# Altium project nir_usb.PrjPcb
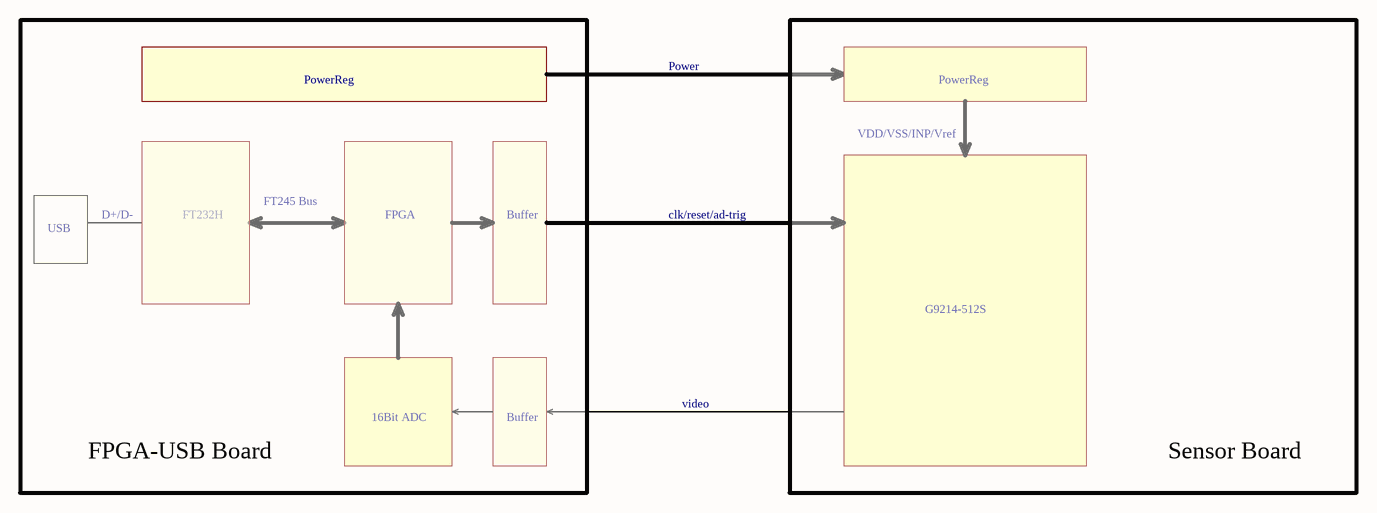
[diagram p0: nir_usb_top.SchDoc]
12 sheets, 173 parts. Net scope: global (net labels, ports and power ports of the same name join across sheets).
Board file: nir_usb.PcbDoc
Sheets:
  nir_usb_top.SchDoc
  place_plan.SchDoc
  calculation_plan.SchDoc
  ft232h.SchDoc
  fpga_io.SchDoc
  fpga_pwr.SchDoc
  adc.SchDoc
  fpga_misc.SchDoc
  adc_buffer.SchDoc
  digi_pwr.SchDoc
  analog_pwr.SchDoc
  digi_5V.SchDoc

## Sheet nir_usb_top.SchDoc
size A4

### Notes on the sheet
- Power
- PowerReg
- VDD/VSS/INP/Vref
- FT245 Bus
- USB
- D+/D-
- FT232H
- FPGA
- Buffer
- clk/reset/ad-trig
- G9214-512S
- video
- FPGA-USB Board
- 16Bit ADC
- Sensor Board

## Sheet place_plan.SchDoc
size A4
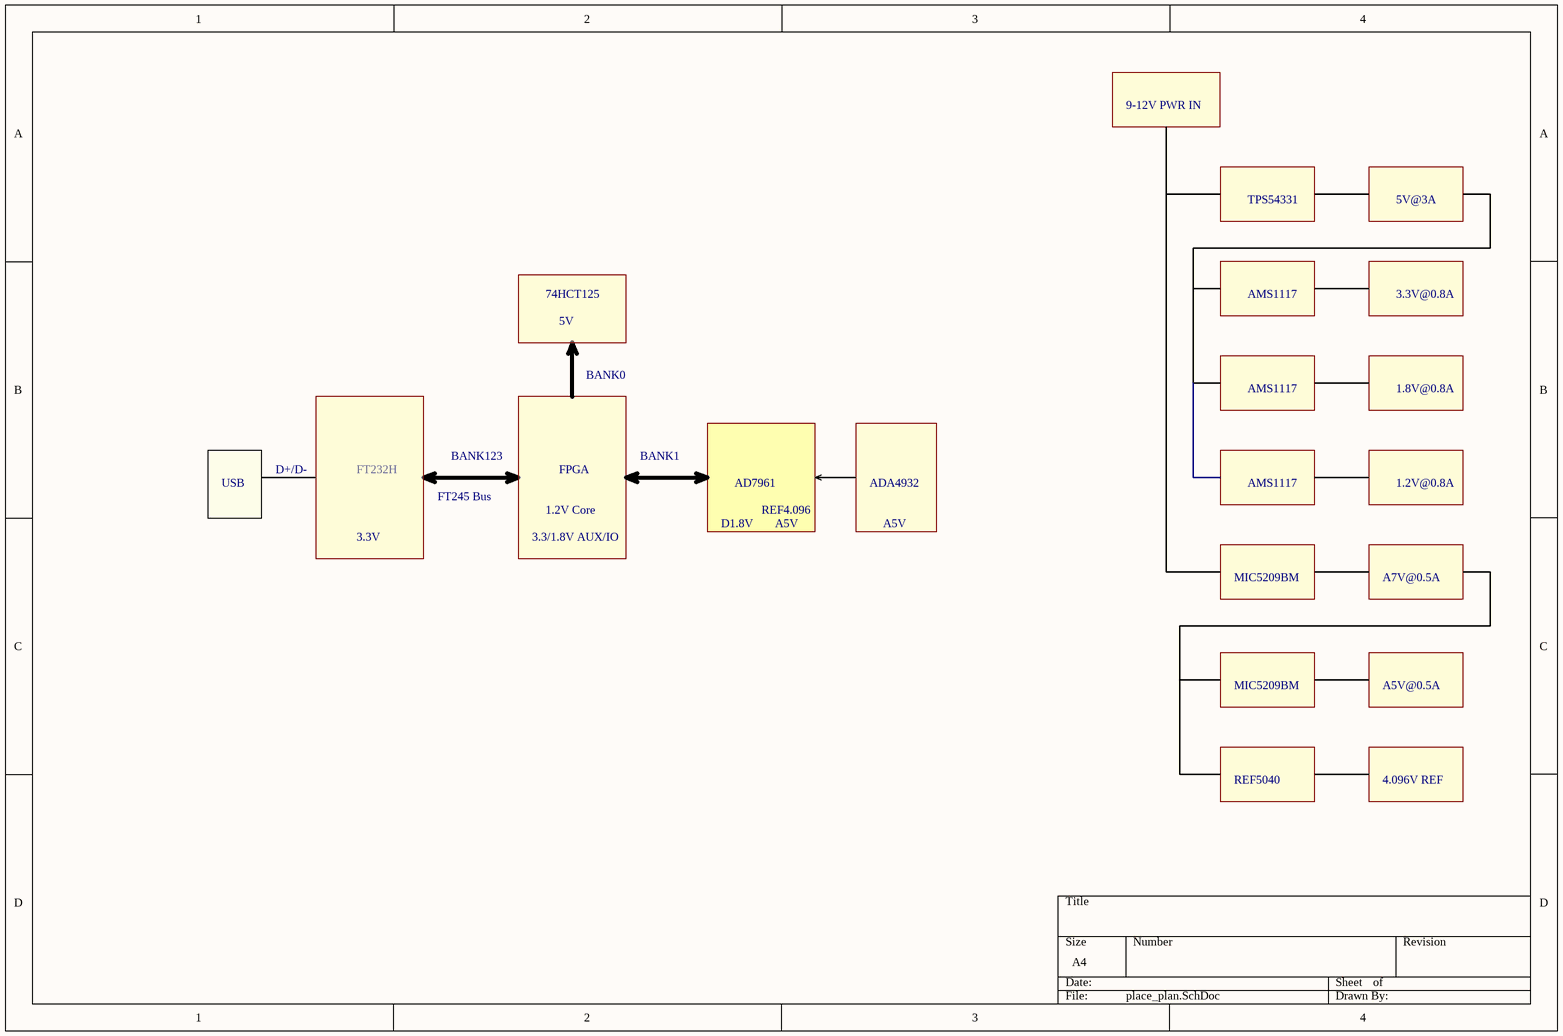
[diagram p1: place_plan.SchDoc]

### Notes on the sheet
- 9-12V PWR IN
- TPS54331
- 5V@3A
- 74HCT125
- AMS1117
- 3.3V@0.8A
- 5V
- BANK0
- 1.8V@0.8A
- USB
- D+/D-
- FT232H
- FT245 Bus
- BANK123
- 1.2V Core
- FPGA
- BANK1
- AD7961
- REF4.096
- ADA4932
- 1.2V@0.8A
- 3.3V
- 3.3/1.8V AUX/IO
- D1.8V
- A5V
- MIC5209BM
- A7V@0.5A
- A5V@0.5A
- REF5040
- 4.096V REF

## Sheet calculation_plan.SchDoc
size A4
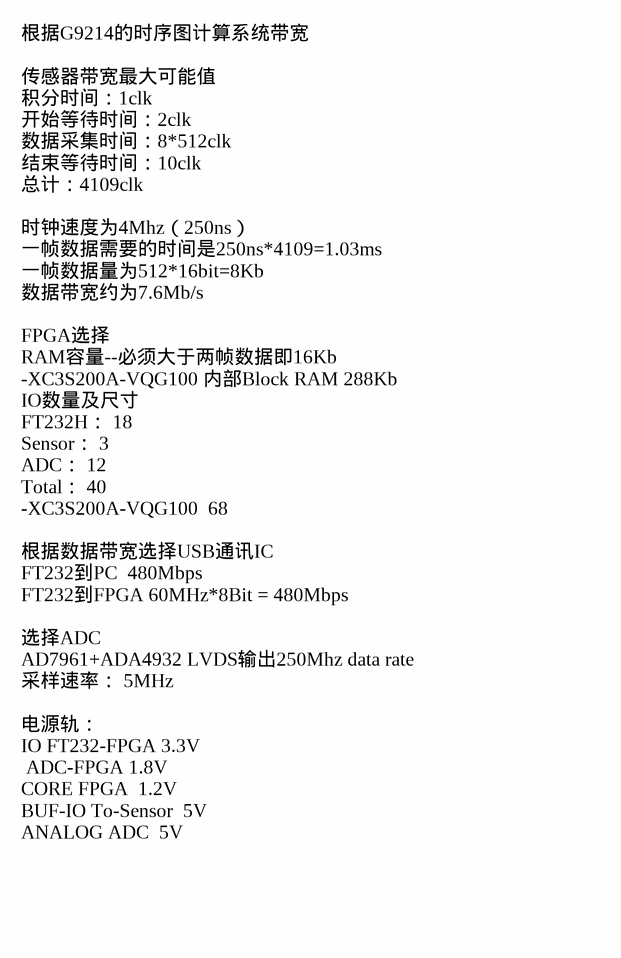
[diagram p2: calculation_plan.SchDoc]

### Notes on the sheet
- 根据G9214的时序图计算系统带宽
  传感器带宽最大可能值
  积分时间：1clk
  开始等待时间：2clk
  数据采集时间：8*512clk
  结束等待时间：10clk
  总计：4109clk
  时钟速度为4Mhz（250ns）
  一帧数据需要的时间是250ns*4109=1.03ms
  一帧数据量为512*16bit=8Kb
  数据带宽约为7.6Mb/s
  FPGA选择
  RAM容量--必须大于两帧数据即16Kb
  -XC3S200A-VQG100 内部Block RAM 288Kb
  IO数量及尺寸
  FT232H：	18
  Sensor：	3
  ADC：	12
  Total：	40
  -XC3S200A-VQG100 	68
  根据数据带宽选择USB通讯IC
  FT232到PC 	480Mbps
  FT232到FPGA	60MHz*8Bit = 480Mbps
  选择ADC
  AD7961+ADA4932	LVDS输出250Mhz data rate
  采样速率：	5MHz
  电源轨：
  IO	FT232-FPGA	3.3V
  ADC-FPGA	1.8V
  CORE	FPGA		1.2V
  BUF-IO	To-Sensor		5V
  ANALOG	ADC		5V

## Sheet ft232h.SchDoc
size A4
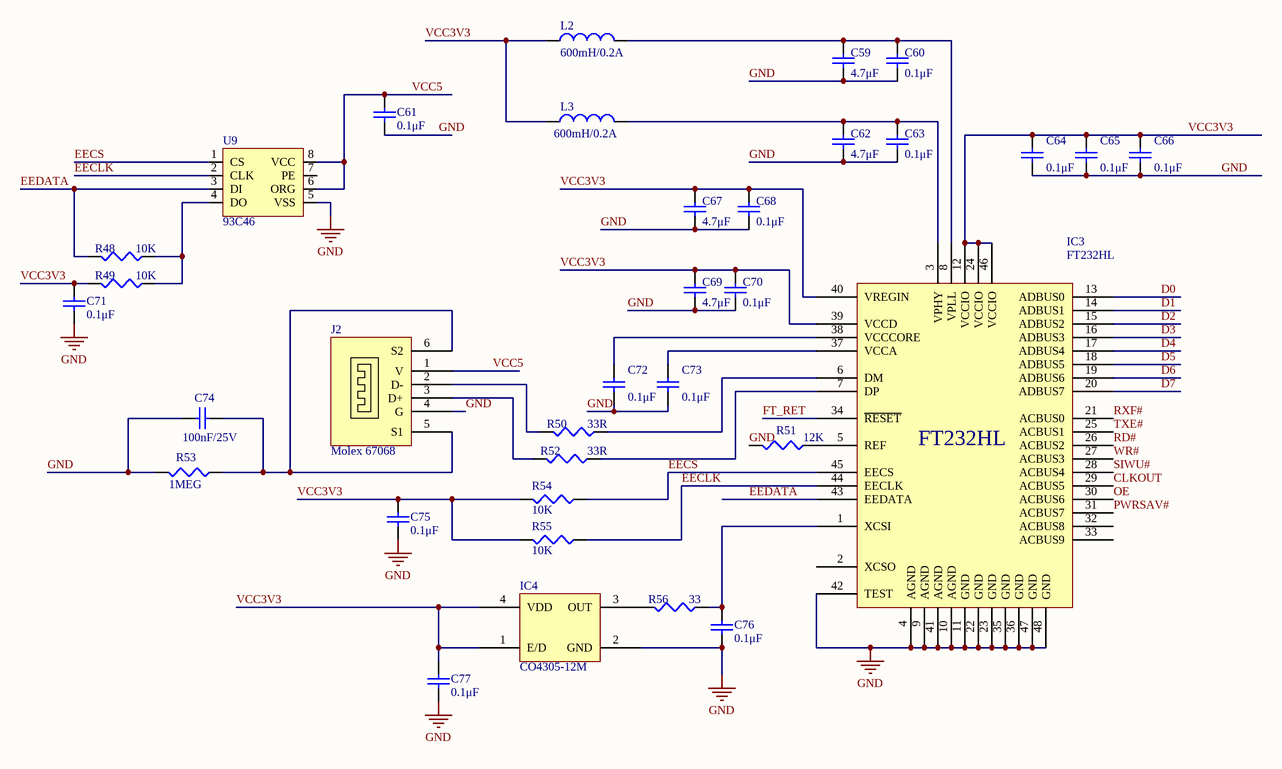
[diagram p3: ft232h.SchDoc]

### Parts
C59  value 4.7μF  [1608[0603]]  (hidden comment: Cap Semi)
C60  value 0.1μF  [1608[0603]]  (hidden comment: Cap Semi)
C61  value 0.1μF  [1608[0603]]  (hidden comment: Cap Semi)
C62  value 4.7μF  [1608[0603]]  (hidden comment: Cap Semi)
C63  value 0.1μF  [1608[0603]]  (hidden comment: Cap Semi)
C64  value 0.1μF  [1608[0603]]  (hidden comment: Cap Semi)
C65  value 0.1μF  [1608[0603]]  (hidden comment: Cap Semi)
C66  value 0.1μF  [1608[0603]]  (hidden comment: Cap Semi)
C67  value 4.7μF  [1608[0603]]  (hidden comment: Cap Semi)
C68  value 0.1μF  [1608[0603]]  (hidden comment: Cap Semi)
C69  value 4.7μF  [1608[0603]]  (hidden comment: Cap Semi)
C70  value 0.1μF  [1608[0603]]  (hidden comment: Cap Semi)
C71  value 0.1μF  [1608[0603]]  (hidden comment: Cap Semi)
C72  value 0.1μF  [1608[0603]]  (hidden comment: Cap Semi)
C73  value 0.1μF  [1608[0603]]  (hidden comment: Cap Semi)
C74  value 100nF/25V  [1608[0603]]  (hidden comment: Cap Semi)
C75  value 0.1μF  [1608[0603]]  (hidden comment: Cap Semi)
C76  value 0.1μF  [1608[0603]]  (hidden comment: Cap Semi)
C77  value 0.1μF  [1608[0603]]  (hidden comment: Cap Semi)
IC3  FT232HL  [LQFP-48_L]
IC4  CO4305-12M  [CO4305-12]
J2  Molex 67068  [USB-A]
L2  value 600mH/0.2A  [0603]  (hidden comment: Inductor)
L3  value 600mH/0.2A  [0603]  (hidden comment: Inductor)
R48  value 10K  [J1-0603]  (hidden comment: Res3)
R49  value 10K  [J1-0603]  (hidden comment: Res3)
R50  value 33R  [J1-0603]  (hidden comment: Res3)
R51  value 12K  [J1-0603]  (hidden comment: Res3)
R52  value 33R  [J1-0603]  (hidden comment: Res3)
R53  value 1MEG  [J1-0603]  (hidden comment: Res3)
R54  value 10K  [J1-0603]  (hidden comment: Res3)
R55  value 10K  [J1-0603]  (hidden comment: Res3)
R56  value 33  [J1-0603]  (hidden comment: Res3)
U9  93C46  [SOIC127P600X175-8N]

### Nets
GND: C59.1 C60.1 C61.1 C62.1 C63.1 C64.1 C65.1 C66.1 C67.1 C68.1 C69.1 C70.1 C71.1 C72.1 C73.1 C74.1 C75.1 C76.1 C77.1 IC3.4(AGND) IC3.9(AGND) IC3.10(AGND) IC3.11(GND) IC3.22(GND) IC3.23(GND) IC3.35(GND) IC3.36(GND) IC3.41(AGND) IC3.42(TEST) IC3.47(GND) IC3.48(GND) IC4.2(GND) J2.4(G) R51.2 R53.2 U9.5(VSS)
CLKOUT: IC3.29(ACBUS5)
D0: IC3.13(ADBUS0)
D1: IC3.14(ADBUS1)
D2: IC3.15(ADBUS2)
D3: IC3.16(ADBUS3)
D4: IC3.17(ADBUS4)
D5: IC3.18(ADBUS5)
D6: IC3.19(ADBUS6)
D7: IC3.20(ADBUS7)
EECLK: IC3.44(EECLK) R55.1 U9.2(CLK)
EECS: IC3.45(EECS) R54.1 U9.1(CS)
EEDATA: IC3.43(EEDATA) R48.2 U9.3(DI)
FT_RET: IC3.34(~{RESET})
OE: IC3.30(ACBUS6)
PWRSAV#: IC3.31(ACBUS7)
RD#: IC3.26(ACBUS2)
RXF#: IC3.21(ACBUS0)
SIWU#: IC3.28(ACBUS4)
TXE#: IC3.25(ACBUS1)
VCC3V3: C64.2 C65.2 C66.2 C67.2 C68.2 C69.2 C70.2 C71.2 C75.2 C77.2 IC3.12(VCCIO) IC3.24(VCCIO) IC3.39(VCCD) IC3.40(VREGIN) IC3.46(VCCIO) IC4.1(E/D) IC4.4(VDD) L2.1 L3.1 R49.2 R54.2 R55.2
VCC5: C61.2 J2.1(V) U9.6(ORG) U9.8(VCC)
WR#: IC3.27(ACBUS3)
NetC59_2: C59.2 C60.2 IC3.8(VPLL) L2.2
NetC62_2: C62.2 C63.2 IC3.3(VPHY) L3.2
NetC72_2: C72.2 IC3.38(VCCCORE)
NetC73_2: C73.2 IC3.37(VCCA)
NetC74_2: C74.2 J2.5(S1) J2.6(S2) R53.1
NetC76_2: C76.2 IC3.1(XCSI) R56.1
NetIC3_5: IC3.5(REF) R51.1
NetIC3_6: IC3.6(DM) R50.1
NetIC3_7: IC3.7(DP) R52.1
NetIC4_3: IC4.3(OUT) R56.2
NetJ2_2: J2.2(D-) R50.2
NetJ2_3: J2.3(D+) R52.2
NetR48_1: R48.1 R49.1 U9.4(DO)

Not connected (* = marked no-connect by the designer): IC3 2(XCSO) 32(ACBUS8) 33(ACBUS9); U9 7(PE)

### Library data of the parts
C59-C77 = Cap Semi: Capacitor (Semiconductor SIM Model); Published: 8-Jun-2000; LatestRevisionDate: 29-May-2009; LatestRevisionNote: IPC-7351 Footprint Added.; PackageReference: C1206; Publisher: Altium Limited; PackageDescription: Chip Capacitor
L2 L3 = Inductor: Code_IEC: 1005; Published: 8-Jun-2000; LatestRevisionDate: 29-May-2009; LatestRevisionNote: IPC-7351 Footprint Added.; PackageReference: 0402-A; Publisher: Altium Limited; PackageDescription: Chip Inductor; Code_JEITA: 0402
R48-R56 = Res3: Resistor; Published: 8-Jun-2000; LatestRevisionDate: 29-May-2009; LatestRevisionNote: IPC-7351 Footprint Added.; PackageReference: J1-0603; Publisher: Altium Limited; PackageDescription: Chip Resistor

## Sheet fpga_io.SchDoc
size A4
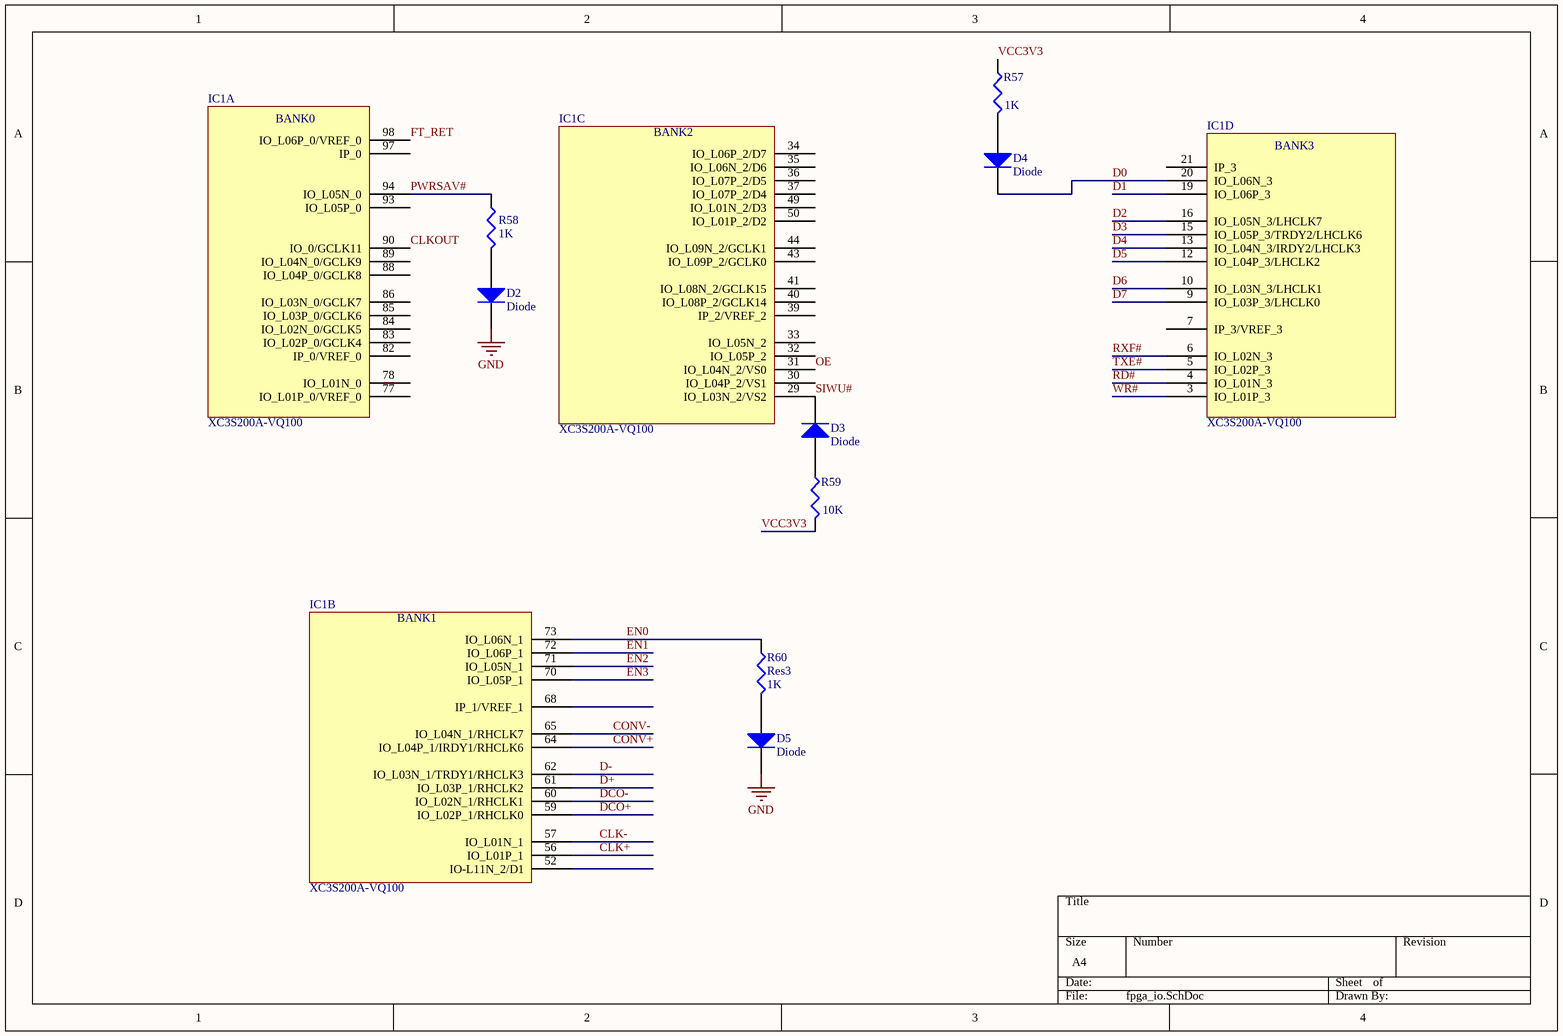
[diagram p4: fpga_io.SchDoc]

### Parts
D2  Diode  [LED0603]
D3  Diode  [LED0603]
D4  Diode  [LED0603]
D5  Diode  [LED0603]
IC1  XC3S200A-VQ100  [QFP50P1600X1600X120-100N]  (parts A,B,C,D of 6)
R57  value 1K  [J1-0603]  (hidden comment: Res3)
R58  value 1K  [J1-0603]  (hidden comment: Res3)
R59  value 10K  [J1-0603]  (hidden comment: Res3)
R60  Res3  value 1K  [J1-0603]

### Nets
GND: D2.2(K) D5.2(K)
CLK+: IC1.56(IO_L01P_1)
CLK-: IC1.57(IO_L01N_1)
CLKOUT: IC1.90(IO_0/GCLK11)
CONV+: IC1.64(IO_L04P_1/IRDY1/RHCLK6)
CONV-: IC1.65(IO_L04N_1/RHCLK7)
D0: D4.2(K) IC1.20(IO_L06N_3)
D1: IC1.19(IO_L06P_3)
D2: IC1.16(IO_L05N_3/LHCLK7)
D3: IC1.15(IO_L05P_3/TRDY2/LHCLK6)
D4: IC1.13(IO_L04N_3/IRDY2/LHCLK3)
D5: IC1.12(IO_L04P_3/LHCLK2)
D6: IC1.10(IO_L03N_3/LHCLK1)
D7: IC1.9(IO_L03P_3/LHCLK0)
D+: IC1.61(IO_L03P_1/RHCLK2)
D-: IC1.62(IO_L03N_1/TRDY1/RHCLK3)
DCO+: IC1.59(IO_L02P_1/RHCLK0)
DCO-: IC1.60(IO_L02N_1/RHCLK1)
EN0: IC1.73(IO_L06N_1) R60.1
EN1: IC1.72(IO_L06P_1)
EN2: IC1.71(IO_L05N_1)
EN3: IC1.70(IO_L05P_1)
FT_RET: IC1.98(IO_L06P_0/VREF_0)
OE: IC1.31(IO_L04N_2/VS0)
PWRSAV#: IC1.94(IO_L05N_0) R58.1
RD#: IC1.4(IO_L01N_3)
RXF#: IC1.6(IO_L02N_3)
SIWU#: D3.2(K) IC1.29(IO_L03N_2/VS2)
TXE#: IC1.5(IO_L02P_3)
VCC3V3: R57.1 R59.2
WR#: IC1.3(IO_L01P_3)
NetD2_1: D2.1(A) R58.2
NetD3_1: D3.1(A) R59.1
NetD4_1: D4.1(A) R57.2
NetD5_1: D5.1(A) R60.2

Not connected (* = marked no-connect by the designer): IC1 7(IP_3/VREF_3) 21(IP_3) 30(IO_L04P_2/VS1) 32(IO_L05P_2) 33(IO_L05N_2) 34(IO_L06P_2/D7) 35(IO_L06N_2/D6) 36(IO_L07P_2/D5) 37(IO_L07P_2/D4) 39(IP_2/VREF_2) 40(IO_L08P_2/GCLK14) 41(IO_L08N_2/GCLK15) 43(IO_L09P_2/GCLK0) 44(IO_L09N_2/GCLK1) 49(IO_L01N_2/D3) 50(IO_L01P_2/D2) 52(IO-L11N_2/D1) 68(IP_1/VREF_1) 77(IO_L01P_0/VREF_0) 78(IO_L01N_0) 82(IP_0/VREF_0) 83(IO_L02P_0/GCLK4) 84(IO_L02N_0/GCLK5) 85(IO_L03P_0/GCLK6) 86(IO_L03N_0/GCLK7) 88(IO_L04P_0/GCLK8) 89(IO_L04N_0/GCLK9) 93(IO_L05P_0) 97(IP_0)

### Notes on the sheet
- (in symbol XC3S200A-VQ100, part A) BANK0
- (in symbol XC3S200A-VQ100, part B) BANK1
- (in symbol XC3S200A-VQ100, part C) BANK2
- (in symbol XC3S200A-VQ100, part D) BANK3

### Library data of the parts
D2-D5 = Diode: Default Diode; Published: 8-Jun-2000; LatestRevisionDate: 17-Jul-2002; LatestRevisionNote: Re-released for DXP Platform.; PackageVersion: Sep-1996; PackageReference: SMC; Publisher: Altium Limited; PackageDescription: DO-214-AB/SMC; 2 C-Bend Leads; Body 7.9 x 5.9 mm, inc. leads (LxW); Code_JEDEC: DO-214-AB
R57-R60 = Res3: Resistor; Published: 8-Jun-2000; LatestRevisionDate: 29-May-2009; LatestRevisionNote: IPC-7351 Footprint Added.; PackageReference: J1-0603; Publisher: Altium Limited; PackageDescription: Chip Resistor

## Sheet fpga_pwr.SchDoc
size A4
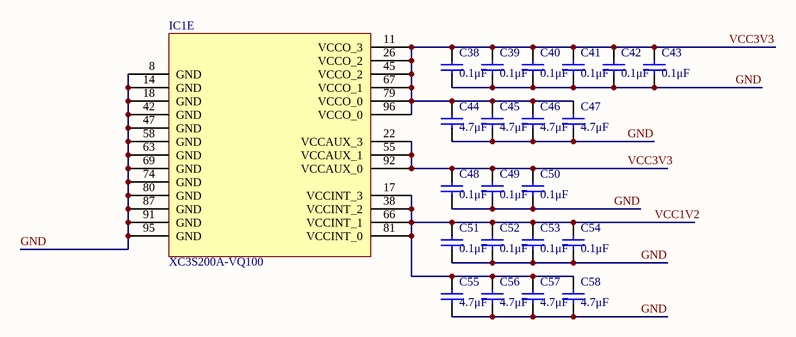
[diagram p5: fpga_pwr.SchDoc]

### Parts
C38  value 0.1μF  [1608[0603]]  (hidden comment: Cap Semi)
C39  value 0.1μF  [1608[0603]]  (hidden comment: Cap Semi)
C40  value 0.1μF  [1608[0603]]  (hidden comment: Cap Semi)
C41  value 0.1μF  [1608[0603]]  (hidden comment: Cap Semi)
C42  value 0.1μF  [1608[0603]]  (hidden comment: Cap Semi)
C43  value 0.1μF  [1608[0603]]  (hidden comment: Cap Semi)
C44  value 4.7μF  [1608[0603]]  (hidden comment: Cap Semi)
C45  value 4.7μF  [1608[0603]]  (hidden comment: Cap Semi)
C46  value 4.7μF  [1608[0603]]  (hidden comment: Cap Semi)
C47  value 4.7μF  [1608[0603]]  (hidden comment: Cap Semi)
C48  value 0.1μF  [1608[0603]]  (hidden comment: Cap Semi)
C49  value 0.1μF  [1608[0603]]  (hidden comment: Cap Semi)
C50  value 0.1μF  [1608[0603]]  (hidden comment: Cap Semi)
C51  value 0.1μF  [1608[0603]]  (hidden comment: Cap Semi)
C52  value 0.1μF  [1608[0603]]  (hidden comment: Cap Semi)
C53  value 0.1μF  [1608[0603]]  (hidden comment: Cap Semi)
C54  value 0.1μF  [1608[0603]]  (hidden comment: Cap Semi)
C55  value 4.7μF  [1608[0603]]  (hidden comment: Cap Semi)
C56  value 4.7μF  [1608[0603]]  (hidden comment: Cap Semi)
C57  value 4.7μF  [1608[0603]]  (hidden comment: Cap Semi)
C58  value 4.7μF  [1608[0603]]  (hidden comment: Cap Semi)
IC1  XC3S200A-VQ100  [QFP50P1600X1600X120-100N]  (part E of 6)

### Nets
GND: C38.1 C39.1 C40.1 C41.1 C42.1 C43.1 C44.1 C45.1 C46.1 C47.1 C48.1 C49.1 C50.1 C51.1 C52.1 C53.1 C54.1 C55.1 C56.1 C57.1 C58.1 IC1.8(GND) IC1.14(GND) IC1.18(GND) IC1.42(GND) IC1.47(GND) IC1.58(GND) IC1.63(GND) IC1.69(GND) IC1.74(GND) IC1.80(GND) IC1.87(GND) IC1.91(GND) IC1.95(GND)
VCC1V2: C51.2 C52.2 C53.2 C54.2 C55.2 C56.2 C57.2 C58.2 IC1.17(VCCINT_3) IC1.38(VCCINT_2) IC1.66(VCCINT_1) IC1.81(VCCINT_0)
VCC3V3: C38.2 C39.2 C40.2 C41.2 C42.2 C43.2 C44.2 C45.2 C46.2 C47.2 C48.2 C49.2 C50.2 IC1.11(VCCO_3) IC1.22(VCCAUX_3) IC1.26(VCCO_2) IC1.45(VCCO_2) IC1.55(VCCAUX_1) IC1.67(VCCO_1) IC1.79(VCCO_0) IC1.92(VCCAUX_0) IC1.96(VCCO_0)

### Library data of the parts
C38-C58 = Cap Semi: Capacitor (Semiconductor SIM Model); Published: 8-Jun-2000; LatestRevisionDate: 29-May-2009; LatestRevisionNote: IPC-7351 Footprint Added.; PackageReference: C1206; Publisher: Altium Limited; PackageDescription: Chip Capacitor

## Sheet adc.SchDoc
size A4
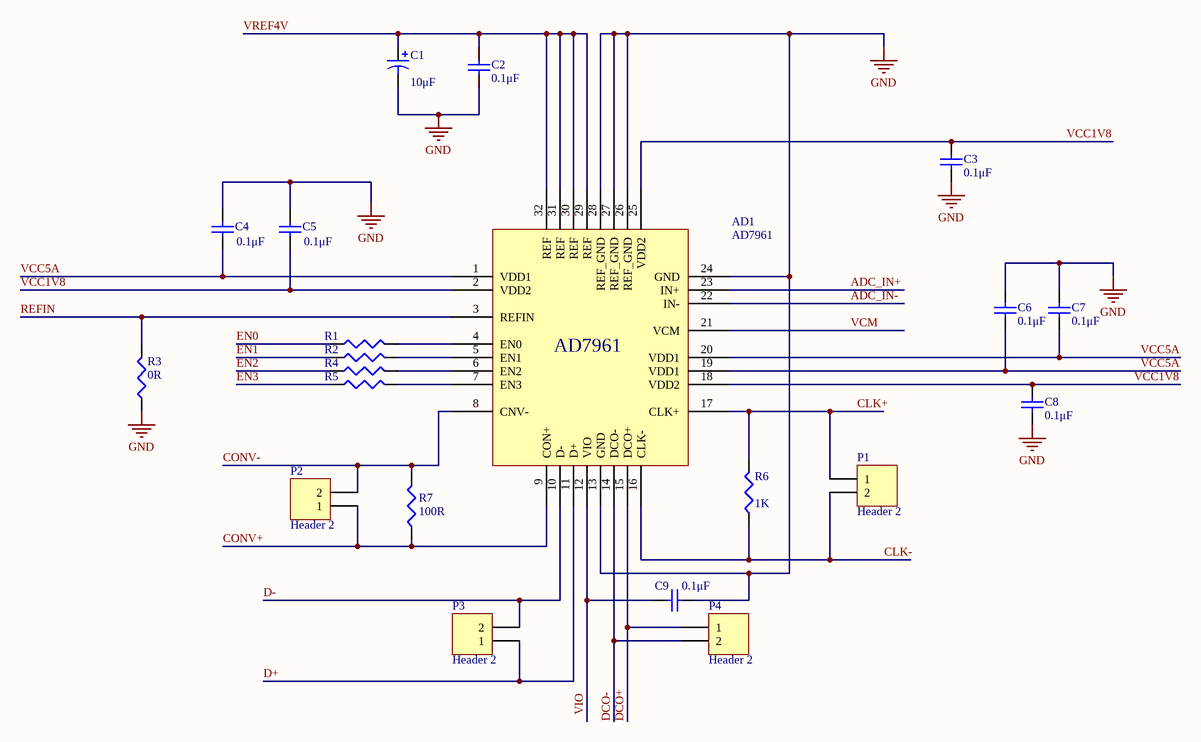
[diagram p6: adc.SchDoc]

### Parts
AD1  AD7961  [QFN50P500X500X80-33N]
C1  value 10μF  [C0805]  (hidden comment: Cap Pol3)
C2  value 0.1μF  [1608[0603]]  (hidden comment: Cap Semi)
C3  value 0.1μF  [1608[0603]]  (hidden comment: Cap Semi)
C4  value 0.1μF  [1608[0603]]  (hidden comment: Cap Semi)
C5  value 0.1μF  [1608[0603]]  (hidden comment: Cap Semi)
C6  value 0.1μF  [1608[0603]]  (hidden comment: Cap Semi)
C7  value 0.1μF  [1608[0603]]  (hidden comment: Cap Semi)
C8  value 0.1μF  [1608[0603]]  (hidden comment: Cap Semi)
C9  value 0.1μF  [1608[0603]]  (hidden comment: Cap Semi)
P1  Header 2  [HDR1X2]
P2  Header 2  [HDR1X2]
P3  Header 2  [HDR1X2]
P4  Header 2  [HDR1X2]
R1  Res3  [J1-0603]  (value not drawn)
R2  Res3  [J1-0603]  (value not drawn)
R3  0R  [J1-0603]
R4  Res3  [J1-0603]  (value not drawn)
R5  Res3  [J1-0603]  (value not drawn)
R6  value 1K  [J1-0603]  (hidden comment: Res3)
R7  value 100R  [J1-0603]  (hidden comment: Res3)

### Nets
GND: AD1.13(GND) AD1.24(GND) AD1.26(REF_GND) AD1.27(REF_GND) AD1.28(REF_GND) C1.2 C2.2 C3.2 C4.2 C5.2 C6.1 C7.1 C8.2 C9.1 R3.1
ADC_IN+: AD1.23(IN+)
ADC_IN-: AD1.22(IN-)
CLK+: AD1.17(CLK+) P1.1 R6.2
CLK-: AD1.16(CLK-) P1.2 R6.1
CONV+: AD1.9(CON+) P2.1 R7.1
CONV-: AD1.8(CNV-) P2.2 R7.2
D+: AD1.11(D+) P3.1
D-: AD1.10(D-) P3.2
DCO+: AD1.15(DCO+) P4.1
DCO-: AD1.14(DCO-) P4.2
EN0: R1.1
EN1: R2.1
EN2: R4.1
EN3: R5.1
REFIN: AD1.3(REFIN) R3.2
VCC1V8: AD1.2(VDD2) AD1.18(VDD2) AD1.25(VDD2) C3.1 C5.1 C8.1
VCC5A: AD1.1(VDD1) AD1.19(VDD1) AD1.20(VDD1) C4.1 C6.2 C7.2
VCM: AD1.21(VCM)
VIO: AD1.12(VIO) C9.2
VREF4V: AD1.29(REF) AD1.30(REF) AD1.31(REF) AD1.32(REF) C1.1 C2.1
NetAD1_4: AD1.4(EN0) R1.2
NetAD1_5: AD1.5(EN1) R2.2
NetAD1_6: AD1.6(EN2) R4.2
NetAD1_7: AD1.7(EN3) R5.2

### Library data of the parts
C1 = Cap Pol3: Polarized Capacitor (Surface Mount); Published: 8-Jun-2000; LatestRevisionDate: 29-May-2009; LatestRevisionNote: IPC-7351 Footprint Added.; PackageReference: C0805; Publisher: Altium Limited; PackageDescription: Chip Capacitor
C2-C9 = Cap Semi: Capacitor (Semiconductor SIM Model); Published: 8-Jun-2000; LatestRevisionDate: 29-May-2009; LatestRevisionNote: IPC-7351 Footprint Added.; PackageReference: C1206; Publisher: Altium Limited; PackageDescription: Chip Capacitor
P1-P4 = Header 2: Header, 2-Pin; LatestRevisionDate: 17-Jul-2002; LatestRevisionNote: Re-released for DXP Platform.; Publisher: Altium Limited
R1-R5 = Res3: Resistor; Value: 1K; Published: 8-Jun-2000; LatestRevisionDate: 29-May-2009; LatestRevisionNote: IPC-7351 Footprint Added.; PackageReference: J1-0603; Publisher: Altium Limited; PackageDescription: Chip Resistor
R6 R7 = Res3: Resistor; Published: 8-Jun-2000; LatestRevisionDate: 29-May-2009; LatestRevisionNote: IPC-7351 Footprint Added.; PackageReference: J1-0603; Publisher: Altium Limited; PackageDescription: Chip Resistor

## Sheet fpga_misc.SchDoc: MISC
size A4; Date: 2014/04/21; Author: fanhx; DrawnBy: fanhx
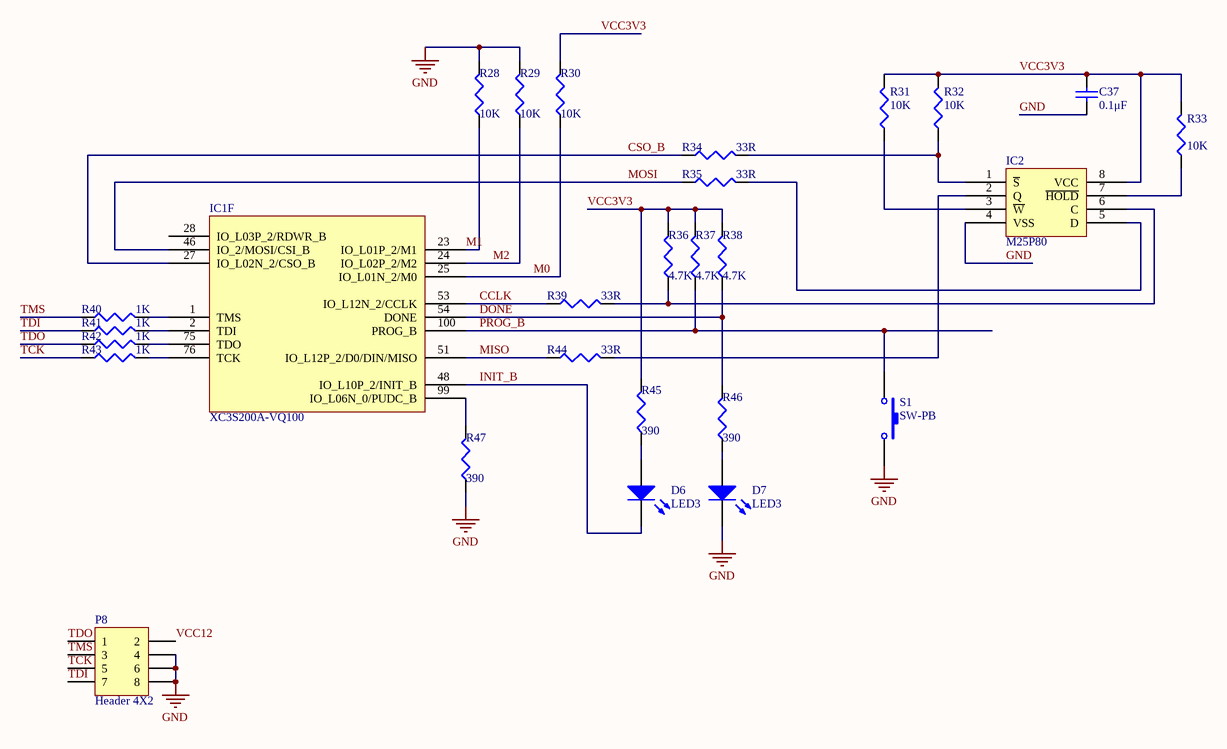
[diagram p7: fpga_misc.SchDoc]

### Parts
C37  value 0.1μF  [1608[0603]]  (hidden comment: Cap Semi)
D6  LED3  [LED0603]
D7  LED3  [LED0603]
IC1  XC3S200A-VQ100  [QFP50P1600X1600X120-100N]  (part F of 6)
IC2  M25P80  [SO8-WIDE8]
P8  Header 4X2  [HDR2X4]
R28  value 10K  [J1-0603]  (hidden comment: Res3)
R29  value 10K  [J1-0603]  (hidden comment: Res3)
R30  value 10K  [J1-0603]  (hidden comment: Res3)
R31  value 10K  [J1-0603]  (hidden comment: Res3)
R32  value 10K  [J1-0603]  (hidden comment: Res3)
R33  value 10K  [J1-0603]  (hidden comment: Res3)
R34  value 33R  [J1-0603]  (hidden comment: Res3)
R35  value 33R  [J1-0603]  (hidden comment: Res3)
R36  value 4.7K  [J1-0603]  (hidden comment: Res3)
R37  value 4.7K  [J1-0603]  (hidden comment: Res3)
R38  value 4.7K  [J1-0603]  (hidden comment: Res3)
R39  value 33R  [J1-0603]  (hidden comment: Res3)
R40  value 1K  [J1-0603]  (hidden comment: Res3)
R41  value 1K  [J1-0603]  (hidden comment: Res3)
R42  value 1K  [J1-0603]  (hidden comment: Res3)
R43  value 1K  [J1-0603]  (hidden comment: Res3)
R44  value 33R  [J1-0603]  (hidden comment: Res3)
R45  value 390  [J1-0603]  (hidden comment: Res3)
R46  value 390  [J1-0603]  (hidden comment: Res3)
R47  value 390  [J1-0603]  (hidden comment: Res3)
S1  SW-PB  [SPST-2]

### Nets
GND: C37.2 D7.2(K) IC2.4(VSS) P8.4 P8.6 P8.8 R28.2 R29.2 R47.1 S1.2
CCLK: IC1.53(IO_L12N_2/CCLK) R39.1
CSO_B: IC1.27(IO_L02N_2/CSO_B) R34.1
DONE: IC1.54(DONE) R38.1 R46.2
INIT_B: D6.2(K) IC1.48(IO_L10P_2/INIT_B)
M0: IC1.25(IO_L01N_2/M0) R30.1
M1: IC1.23(IO_L01P_2/M1) R28.1
M2: IC1.24(IO_L02P_2/M2) R29.1
MISO: IC1.51(IO_L12P_2/D0/DIN/MISO) R44.1
MOSI: IC1.46(IO_2/MOSI/CSI_B) R35.1
PROG_B: IC1.100(PROG_B) R37.1 S1.1
TCK: P8.5 R43.1
TDI: P8.7 R41.1
TDO: P8.1 R42.1
TMS: P8.3 R40.1
VCC3V3: C37.1 IC2.8(VCC) R30.2 R31.2 R32.2 R33.2 R36.2 R37.2 R38.2 R45.2
VCC12: P8.2
NetD6_1: D6.1(A) R45.1
NetD7_1: D7.1(A) R46.1
NetIC1_1: IC1.1(TMS) R40.2
NetIC1_2: IC1.2(TDI) R41.2
NetIC1_75: IC1.75(TDO) R42.2
NetIC1_76: IC1.76(TCK) R43.2
NetIC1_99: IC1.99(IO_L06N_0/PUDC_B) R47.2
NetIC2_1: IC2.1(~{S}) R32.1 R34.2
NetIC2_2: IC2.2(Q) R44.2
NetIC2_3: IC2.3(~{W}) R31.1
NetIC2_5: IC2.5(D) R35.2
NetIC2_6: IC2.6(C) R36.1 R39.2
NetIC2_7: IC2.7(~{HOLD}) R33.1

Not connected (* = marked no-connect by the designer): IC1 28(IO_L03P_2/RDWR_B)

### Library data of the parts
C37 = Cap Semi: Capacitor (Semiconductor SIM Model); Published: 8-Jun-2000; LatestRevisionDate: 29-May-2009; LatestRevisionNote: IPC-7351 Footprint Added.; PackageReference: C1206; Publisher: Altium Limited; PackageDescription: Chip Capacitor
D6 D7 = LED3: Typical BLUE SiC LED; Published: 8-Jun-2000; LatestRevisionDate: 17-Dec-2003; LatestRevisionNote: PCB Footprint replaced.; DatasheetVersion: 16-Apr-2002; PackageVersion: 16-Apr-2002; PackageReference: 3.5X2.8X1.9; Publisher: Altium Limited; PackageDescription: SM LED; 2 C-Bend Leads; Body 3.5 x 2.8 x 1.9 mm, inc leads (LxWxH typ)
P8 = Header 4X2: Header, 4-Pin, Dual row; LatestRevisionDate: 17-Jul-2002; LatestRevisionNote: Re-released for DXP Platform.; Publisher: Altium Limited
R28-R47 = Res3: Resistor; Published: 8-Jun-2000; LatestRevisionDate: 29-May-2009; LatestRevisionNote: IPC-7351 Footprint Added.; PackageReference: J1-0603; Publisher: Altium Limited; PackageDescription: Chip Resistor
S1 = SW-PB: Switch; Published: 24-Mar-1999; LatestRevisionDate: 17-Jul-2002; LatestRevisionNote: Re-released for DXP Platform.; PackageReference: SPST-2; Publisher: Altium Limited; PackageDescription: Switch; 2 Leads

## Sheet adc_buffer.SchDoc
size A4
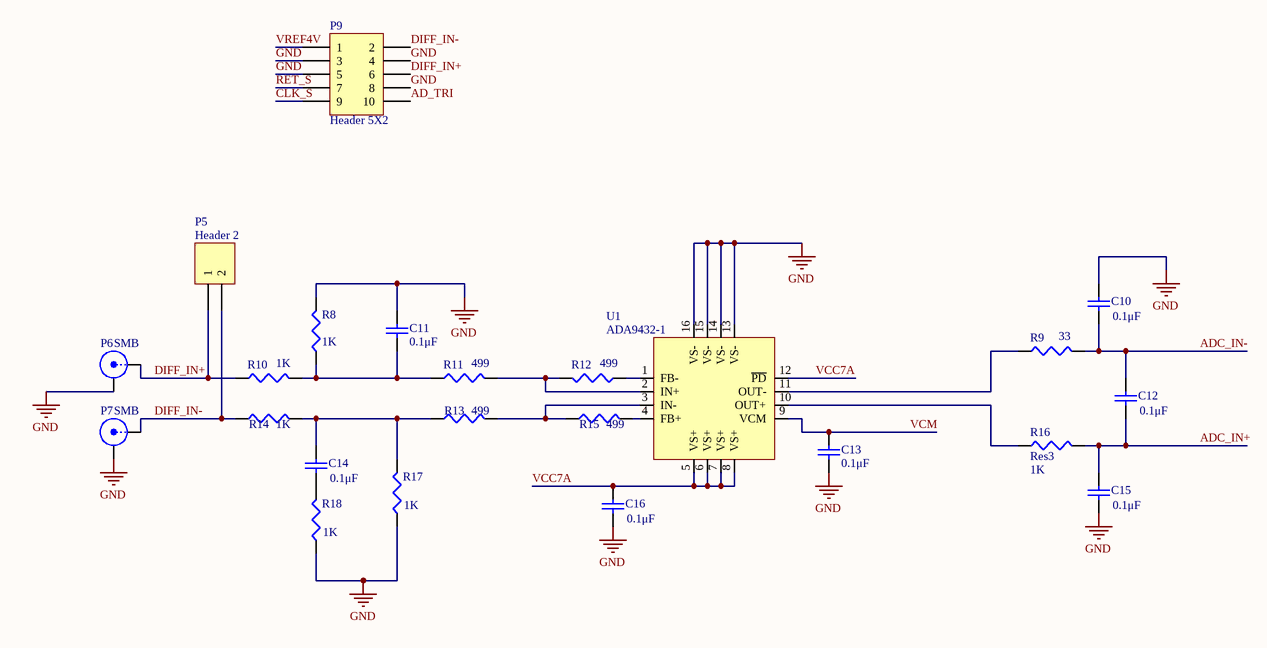
[diagram p8: adc_buffer.SchDoc]

### Parts
C10  value 0.1μF  [1608[0603]]  (hidden comment: Cap Semi)
C11  value 0.1μF  [1608[0603]]  (hidden comment: Cap Semi)
C12  value 0.1μF  [1608[0603]]  (hidden comment: Cap Semi)
C13  value 0.1μF  [1608[0603]]  (hidden comment: Cap Semi)
C14  value 0.1μF  [1608[0603]]  (hidden comment: Cap Semi)
C15  value 0.1μF  [1608[0603]]  (hidden comment: Cap Semi)
C16  value 0.1μF  [1608[0603]]  (hidden comment: Cap Semi)
P5  Header 2  [HDR1X2]
P6  SMB  [SMB_V-RJ45]
P7  SMB  [SMB_V-RJ45]
P9  Header 5X2  [HDR2X5]
R8  value 1K  [J1-0603]  (hidden comment: Res3)
R9  value 33  [J1-0603]  (hidden comment: Res3)
R10  value 1K  [J1-0603]  (hidden comment: Res3)
R11  value 499  [J1-0603]  (hidden comment: Res3)
R12  value 499  [J1-0603]  (hidden comment: Res3)
R13  value 499  [J1-0603]  (hidden comment: Res3)
R14  value 1K  [J1-0603]  (hidden comment: Res3)
R15  value 499  [J1-0603]  (hidden comment: Res3)
R16  Res3  value 1K  [J1-0603]
R17  value 1K  [J1-0603]  (hidden comment: Res3)
R18  value 1K  [J1-0603]  (hidden comment: Res3)
U1  ADA9432-1  [QFN50P300X300X100VQ-17N]

### Nets
GND: C10.2 C11.2 C13.1 C15.1 C16.1 P6.2(Y) P7.2(Y) P9.3 P9.4 P9.5 P9.8 R8.2 R17.1 R18.1 U1.13(VS-) U1.14(VS-) U1.15(VS-) U1.16(VS-)
AD_TRI: P9.10
ADC_IN+: C12.1 C15.2 R16.2
ADC_IN-: C10.1 C12.2 R9.2
CLK_S: P9.9
DIFF_IN+: P5.1 P6.1(X) P9.6 R10.1
DIFF_IN-: P5.2 P7.1(X) P9.2 R14.1
RET_S: P9.7
VCC7A: C16.2 U1.5(VS+) U1.6(VS+) U1.7(VS+) U1.8(VS+) U1.12(~{PD})
VCM: C13.2 U1.9(VCM)
VREF4V: P9.1
NetC11_1: C11.1 R8.1 R10.2 R11.1
NetC14_1: C14.1 R18.2
NetC14_2: C14.2 R13.1 R14.2 R17.2
NetR9_1: R9.1 U1.11(OUT-)
NetR11_2: R11.2 R12.2 U1.2(IN+)
NetR12_1: R12.1 U1.1(FB-)
NetR13_2: R13.2 R15.1 U1.3(IN-)
NetR15_2: R15.2 U1.4(FB+)
NetR16_1: R16.1 U1.10(OUT+)

### Library data of the parts
C10-C16 = Cap Semi: Capacitor (Semiconductor SIM Model); Published: 8-Jun-2000; LatestRevisionDate: 29-May-2009; LatestRevisionNote: IPC-7351 Footprint Added.; PackageReference: C1206; Publisher: Altium Limited; PackageDescription: Chip Capacitor
P5 = Header 2: Header, 2-Pin; LatestRevisionDate: 17-Jul-2002; LatestRevisionNote: Re-released for DXP Platform.; Publisher: Altium Limited
P6 P7 = SMB: SMB Straight Connector; LatestRevisionDate: 17-Jul-2002; LatestRevisionNote: Re-released for DXP Platform.; Publisher: Altium Limited
P9 = Header 5X2: Header, 5-Pin, Dual row; LatestRevisionDate: 17-Jul-2002; LatestRevisionNote: Re-released for DXP Platform.; Publisher: Altium Limited
R8-R18 = Res3: Resistor; Published: 8-Jun-2000; LatestRevisionDate: 29-May-2009; LatestRevisionNote: IPC-7351 Footprint Added.; PackageReference: J1-0603; Publisher: Altium Limited; PackageDescription: Chip Resistor

## Sheet digi_pwr.SchDoc
size A4
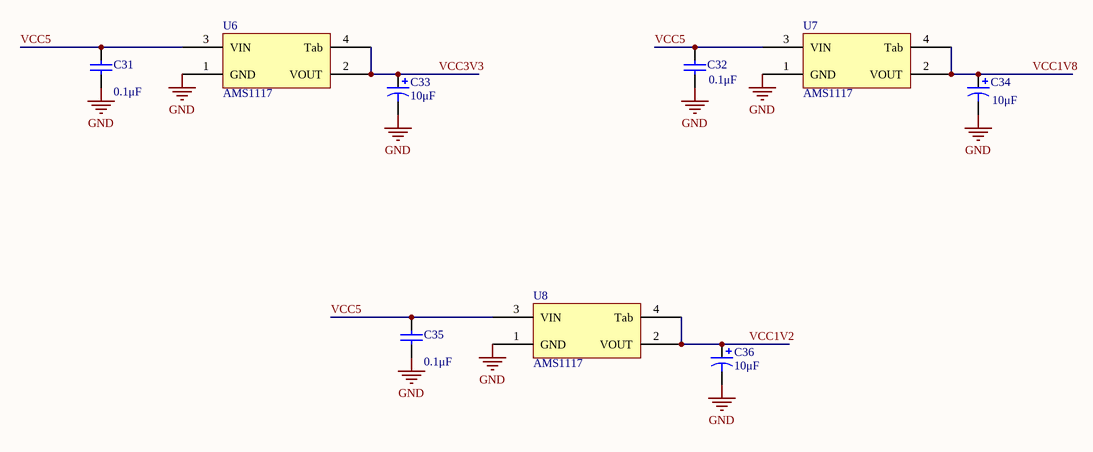
[diagram p9: digi_pwr.SchDoc]

### Parts
C31  value 0.1μF  [1608[0603]]  (hidden comment: Cap Semi)
C32  value 0.1μF  [1608[0603]]  (hidden comment: Cap Semi)
C33  value 10μF  [C0805]  (hidden comment: Cap Pol3)
C34  value 10μF  [C0805]  (hidden comment: Cap Pol3)
C35  value 0.1μF  [1608[0603]]  (hidden comment: Cap Semi)
C36  value 10μF  [C0805]  (hidden comment: Cap Pol3)
U6  AMS1117  [SOT-223]
U7  AMS1117  [SOT-223]
U8  AMS1117  [SOT-223]

### Nets
GND: C31.1 C32.1 C33.2 C34.2 C35.1 C36.2 U6.1(GND) U7.1(GND) U8.1(GND)
VCC1V2: C36.1 U8.2(VOUT) U8.4(Tab)
VCC1V8: C34.1 U7.2(VOUT) U7.4(Tab)
VCC3V3: C33.1 U6.2(VOUT) U6.4(Tab)
VCC5: C31.2 C32.2 C35.2 U6.3(VIN) U7.3(VIN) U8.3(VIN)

### Library data of the parts
C31 C32 C35 = Cap Semi: Capacitor (Semiconductor SIM Model); Published: 8-Jun-2000; LatestRevisionDate: 29-May-2009; LatestRevisionNote: IPC-7351 Footprint Added.; PackageReference: C1206; Publisher: Altium Limited; PackageDescription: Chip Capacitor
C33 C34 C36 = Cap Pol3: Polarized Capacitor (Surface Mount); Published: 8-Jun-2000; LatestRevisionDate: 29-May-2009; LatestRevisionNote: IPC-7351 Footprint Added.; PackageReference: C0805; Publisher: Altium Limited; PackageDescription: Chip Capacitor

## Sheet analog_pwr.SchDoc
size A4
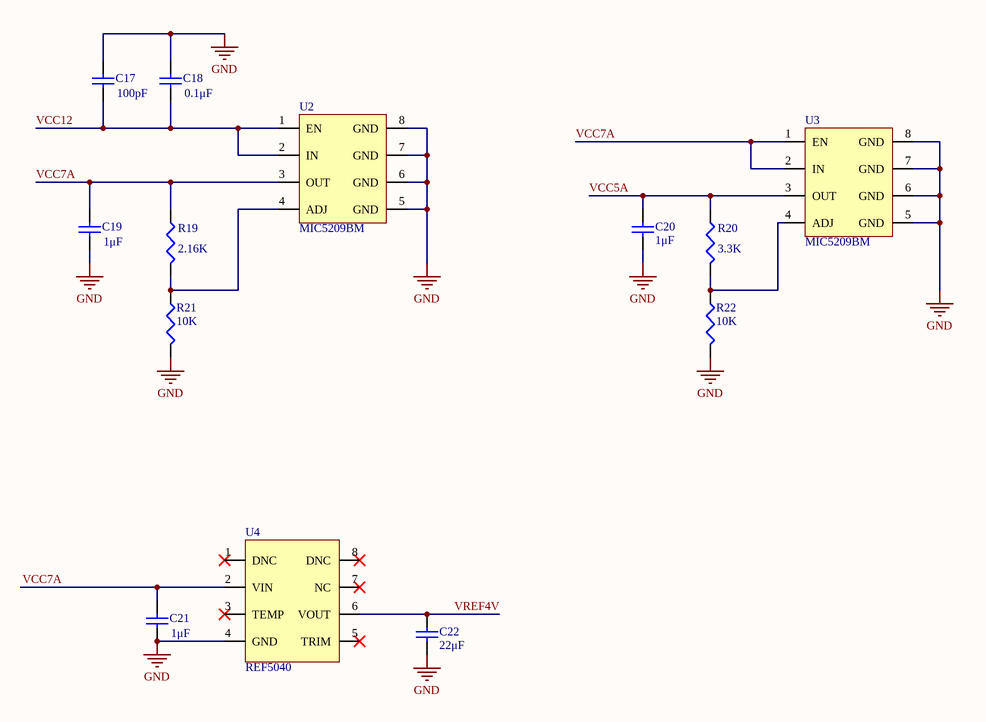
[diagram p10: analog_pwr.SchDoc]

### Parts
C17  value 100pF  [1608[0603]]  (hidden comment: Cap Semi)
C18  value 0.1μF  [1608[0603]]  (hidden comment: Cap Semi)
C19  value 1μF  [1608[0603]]  (hidden comment: Cap Semi)
C20  value 1μF  [1608[0603]]  (hidden comment: Cap Semi)
C21  value 1μF  [1608[0603]]  (hidden comment: Cap Semi)
C22  value 22μF  [1608[0603]]  (hidden comment: Cap Semi)
R19  value 2.16K  [J1-0603]  (hidden comment: Res3)
R20  value 3.3K  [J1-0603]  (hidden comment: Res3)
R21  value 10K  [J1-0603]  (hidden comment: Res3)
R22  value 10K  [J1-0603]  (hidden comment: Res3)
U2  MIC5209BM  [SOIC127P600X175-8N]
U3  MIC5209BM  [SOIC127P600X175-8N]
U4  REF5040  [SOIC127P600X175-8N]

### Nets
GND: C17.2 C18.2 C19.1 C20.1 C21.1 C22.1 R21.2 R22.2 U2.5(GND) U2.6(GND) U2.7(GND) U2.8(GND) U3.5(GND) U3.6(GND) U3.7(GND) U3.8(GND) U4.4(GND)
VCC5A: C20.2 R20.1 U3.3(OUT)
VCC7A: C19.2 C21.2 R19.1 U2.3(OUT) U3.1(EN) U3.2(IN) U4.2(VIN)
VCC12: C17.1 C18.1 U2.1(EN) U2.2(IN)
VREF4V: C22.2 U4.6(VOUT)
NetR19_2: R19.2 R21.1 U2.4(ADJ)
NetR20_2: R20.2 R22.1 U3.4(ADJ)

Not connected (* = marked no-connect by the designer): U4 1(DNC)* 3(TEMP)* 5(TRIM)* 7(NC)* 8(DNC)*

### Library data of the parts
C17-C22 = Cap Semi: Capacitor (Semiconductor SIM Model); Published: 8-Jun-2000; LatestRevisionDate: 29-May-2009; LatestRevisionNote: IPC-7351 Footprint Added.; PackageReference: C1206; Publisher: Altium Limited; PackageDescription: Chip Capacitor
R19-R22 = Res3: Resistor; Published: 8-Jun-2000; LatestRevisionDate: 29-May-2009; LatestRevisionNote: IPC-7351 Footprint Added.; PackageReference: J1-0603; Publisher: Altium Limited; PackageDescription: Chip Resistor

## Sheet digi_5V.SchDoc
size A4
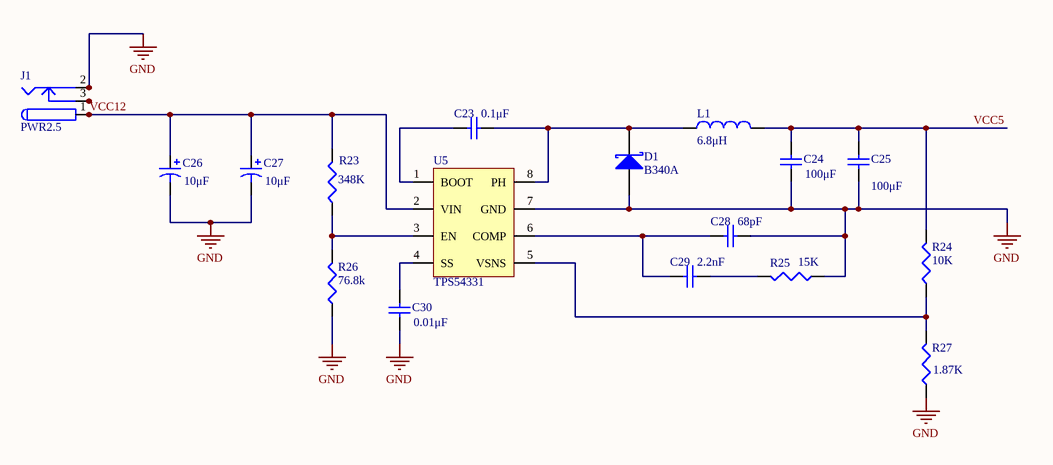
[diagram p11: digi_5V.SchDoc]

### Parts
C23  value 0.1μF  [1608[0603]]  (hidden comment: Cap Semi)
C24  value 100μF  [1608[0603]]  (hidden comment: Cap Semi)
C25  value 100μF  [1608[0603]]  (hidden comment: Cap Semi)
C26  value 10μF  [C0805]  (hidden comment: Cap Pol3)
C27  value 10μF  [C0805]  (hidden comment: Cap Pol3)
C28  value 68pF  [1608[0603]]  (hidden comment: Cap Semi)
C29  value 2.2nF  [1608[0603]]  (hidden comment: Cap Semi)
C30  value 0.01μF  [1608[0603]]  (hidden comment: Cap Semi)
D1  B340A  [LED0603]
J1  PWR2.5  [KLD-0202]
L1  value 6.8μH  [LC Inductor 127]  (hidden comment: Inductor)
R23  value 348K  [J1-0603]  (hidden comment: Res3)
R24  value 10K  [J1-0603]  (hidden comment: Res3)
R25  value 15K  [J1-0603]  (hidden comment: Res3)
R26  value 76.8k  [J1-0603]  (hidden comment: Res3)
R27  value 1.87K  [J1-0603]  (hidden comment: Res3)
U5  TPS54331  [SOIC127P600X175-8N]

### Nets
GND: C24.1 C25.1 C26.2 C27.2 C28.1 C30.1 D1.1(A) J1.2 J1.2A J1.2B R25.1 R26.1 R27.1 U5.7(GND)
VCC5: C24.2 C25.2 L1.2 R24.2
VCC12: C26.1 C27.1 J1.1 J1.1A J1.1B R23.2 U5.2(VIN)
NetC23_1: C23.1 U5.1(BOOT)
NetC23_2: C23.2 D1.2(K) L1.1 U5.8(PH)
NetC28_2: C28.2 C29.1 U5.6(COMP)
NetC29_2: C29.2 R25.2
NetC30_2: C30.2 U5.4(SS)
NetJ1_3: J1.3 J1.3A J1.3B
NetR23_1: R23.1 R26.2 U5.3(EN)
NetR24_1: R24.1 R27.2 U5.5(VSNS)

### Library data of the parts
C23-C25 C28-C30 = Cap Semi: Capacitor (Semiconductor SIM Model); Published: 8-Jun-2000; LatestRevisionDate: 29-May-2009; LatestRevisionNote: IPC-7351 Footprint Added.; PackageReference: C1206; Publisher: Altium Limited; PackageDescription: Chip Capacitor
C26 C27 = Cap Pol3: Polarized Capacitor (Surface Mount); Published: 8-Jun-2000; LatestRevisionDate: 29-May-2009; LatestRevisionNote: IPC-7351 Footprint Added.; PackageReference: C0805; Publisher: Altium Limited; PackageDescription: Chip Capacitor
D1 = D Schottky: Schottky Diode; Published: 8-Jun-2000; LatestRevisionDate: 17-Jul-2002; LatestRevisionNote: Re-released for DXP Platform.; PackageReference: SMB; Publisher: Altium Limited; PackageDescription: DO-214-AA/SMB; 2 C-Bend Leads; Body 5.3 x 3.6 mm, inc. leads (LxW); Code_JEDEC: DO-214-AA
J1 = PWR2.5: Low Voltage Power Supply Connector; Published: 17-Dec-2003; DatasheetDocument: 09-May-2002; Publisher: Altium Limited; ComponentLink1Description: Manufacturer Link; ComponentLink1URL: http://domino.kycon.com/internet/Products.html
L1 = Inductor: Code_IEC: 1005; Published: 8-Jun-2000; LatestRevisionDate: 29-May-2009; LatestRevisionNote: IPC-7351 Footprint Added.; PackageReference: 0402-A; Publisher: Altium Limited; PackageDescription: Chip Inductor; Code_JEITA: 0402
R23-R27 = Res3: Resistor; Published: 8-Jun-2000; LatestRevisionDate: 29-May-2009; LatestRevisionNote: IPC-7351 Footprint Added.; PackageReference: J1-0603; Publisher: Altium Limited; PackageDescription: Chip Resistor

## Nets that join several sheets
GND: ft232h (36 pins), fpga_io (D2.2 D5.2), fpga_pwr (34 pins), adc (15 pins), fpga_misc (10 pins), adc_buffer (18 pins), digi_pwr (9 pins), analog_pwr (17 pins), digi_5V (14 pins)
ADC_IN+: adc (AD1.23), adc_buffer (C12.1 C15.2 R16.2)
ADC_IN-: adc (AD1.22), adc_buffer (C10.1 C12.2 R9.2)
CLK+: fpga_io (IC1.56), adc (AD1.17 P1.1 R6.2)
CLK-: fpga_io (IC1.57), adc (AD1.16 P1.2 R6.1)
CLKOUT: ft232h (IC3.29), fpga_io (IC1.90)
CONV+: fpga_io (IC1.64), adc (AD1.9 P2.1 R7.1)
CONV-: fpga_io (IC1.65), adc (AD1.8 P2.2 R7.2)
D0: ft232h (IC3.13), fpga_io (D4.2 IC1.20)
D1: ft232h (IC3.14), fpga_io (IC1.19)
D2: ft232h (IC3.15), fpga_io (IC1.16)
D3: ft232h (IC3.16), fpga_io (IC1.15)
D4: ft232h (IC3.17), fpga_io (IC1.13)
D5: ft232h (IC3.18), fpga_io (IC1.12)
D6: ft232h (IC3.19), fpga_io (IC1.10)
D7: ft232h (IC3.20), fpga_io (IC1.9)
D+: fpga_io (IC1.61), adc (AD1.11 P3.1)
D-: fpga_io (IC1.62), adc (AD1.10 P3.2)
DCO+: fpga_io (IC1.59), adc (AD1.15 P4.1)
DCO-: fpga_io (IC1.60), adc (AD1.14 P4.2)
EN0: fpga_io (IC1.73 R60.1), adc (R1.1)
EN1: fpga_io (IC1.72), adc (R2.1)
EN2: fpga_io (IC1.71), adc (R4.1)
EN3: fpga_io (IC1.70), adc (R5.1)
FT_RET: ft232h (IC3.34), fpga_io (IC1.98)
OE: ft232h (IC3.30), fpga_io (IC1.31)
PWRSAV#: ft232h (IC3.31), fpga_io (IC1.94 R58.1)
RD#: ft232h (IC3.26), fpga_io (IC1.4)
RXF#: ft232h (IC3.21), fpga_io (IC1.6)
SIWU#: ft232h (IC3.28), fpga_io (D3.2 IC1.29)
TXE#: ft232h (IC3.25), fpga_io (IC1.5)
VCC1V2: fpga_pwr (12 pins), digi_pwr (C36.1 U8.2 U8.4)
VCC1V8: adc (6 pins), digi_pwr (C34.1 U7.2 U7.4)
VCC3V3: ft232h (22 pins), fpga_io (R57.1 R59.2), fpga_pwr (22 pins), fpga_misc (10 pins), digi_pwr (C33.1 U6.2 U6.4)
VCC5: ft232h (C61.2 J2.1 U9.6 U9.8), digi_pwr (6 pins), digi_5V (C24.2 C25.2 L1.2 R24.2)
VCC5A: adc (6 pins), analog_pwr (C20.2 R20.1 U3.3)
VCC7A: adc_buffer (6 pins), analog_pwr (7 pins)
VCC12: fpga_misc (P8.2), analog_pwr (C17.1 C18.1 U2.1 U2.2), digi_5V (7 pins)
VCM: adc (AD1.21), adc_buffer (C13.2 U1.9)
VREF4V: adc (6 pins), adc_buffer (P9.1), analog_pwr (C22.2 U4.6)
WR#: ft232h (IC3.27), fpga_io (IC1.3)